# EAGLE design power (EAGLE 9.6.2)

## Sheet 1 of 4: main rov power

## Sheet 2 of 4: thrusters power
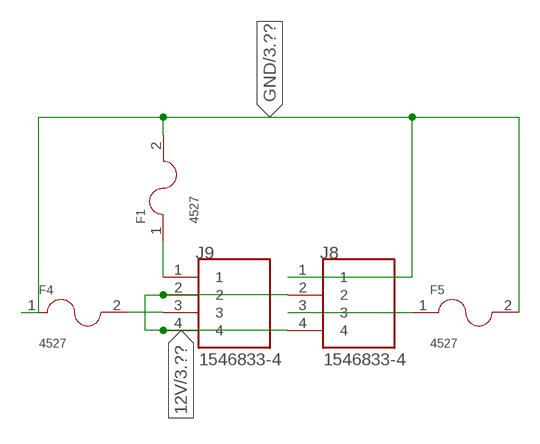
[diagram p0: schematic, sheet 2]

### Parts
F1  4527  [FUSE_4527]
F4  4527  [FUSE_4527]
F5  4527  [FUSE_4527]
J8  1546833-4  [TE_1546833-4]
J9  1546833-4  [TE_1546833-4]

### Nets
12V: J8.2 J8.4 J9.2 J9.4 ; also sheet 3,4
GND: F1.2 F4.1 F5.2 J8.1 ; also sheet 3,4
N$5: F4.2 J9.3
N$6: F5.1 J8.3
N$8: F1.1 J9.1

## Sheet 3 of 4: arm power + cameras power
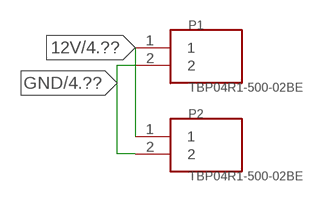
[diagram p1: schematic, sheet 3]

### Parts
P1  TBP04R1-500-02BE  [CUI_TBP04R1-500-02BE]
P2  TBP04R1-500-02BE  [CUI_TBP04R1-500-02BE]

### Nets
12V: P1.1 P2.1 ; also sheet 2,4
GND: P1.2 P2.2 ; also sheet 2,4

## Sheet 4 of 4: control power
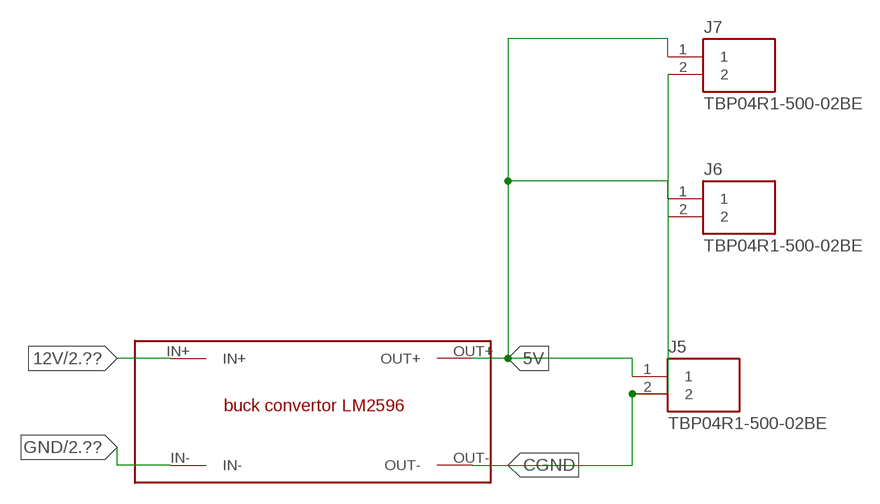
[diagram p2: schematic, sheet 4]

### Parts
J5  TBP04R1-500-02BE  [CUI_TBP04R1-500-02BE]
J6  TBP04R1-500-02BE  [CUI_TBP04R1-500-02BE]
J7  TBP04R1-500-02BE  [CUI_TBP04R1-500-02BE]
U$1  LM2596  [LM2596]

### Nets
5V: J5.1 J6.1 J7.1 U$1.OUT+
12V: U$1.IN+ ; also sheet 2,3
CGND: J5.2 J6.2 J7.2 U$1.OUT-
GND: U$1.IN- ; also sheet 2,3

## Library data of the parts
F1 F4 F5 = fuse holder:4527: Check availability <https://pricing.snapeda.com/parts/4527/Keystone/view-part?ref=eda>; AVAILABILITY: In Stock; CHECK_PRICES: https://www.snapeda.com/parts/4527/Keystone/view-part/?ref=eda; DESCRIPTION: 5mm Low Profile Holder; MF: Keystone; MP: 4527; PACKAGE: None; PRICE: None; SNAPEDA_LINK: https://www.snapeda.com/parts/4527/Keystone/view-part/?ref=snap
J5-J7 P1 P2 = pluggable terminal block:TBP04R1-500-02BE: Terminal Block Check availability <https://pricing.snapeda.com/parts/TBP04R1-500-02BE/Same%20Sky/view-part?ref=eda>; AVAILABILITY: In Stock; CHECK_PRICES: https://www.snapeda.com/parts/TBP04R1-500-02BE/Same+Sky/view-part/?ref=eda; DESCRIPTION: 2~24 Poles, Pluggable, Receptacle, Horizontal, 5.0 Pitch, Terminal Block Connector; MF: Same Sky; MP: TBP04R1-500-02BE; PACKAGE: None; PRICE: None; SNAPEDA_LINK: https://www.snapeda.com/parts/TBP04R1-500-02BE/Same+Sky/view-part/?ref=snap
J8 J9 = 1546833-4:1546833-4: Check availability <https://pricing.snapeda.com/parts/1546833-4/TE%20Connectivity/view-part?ref=eda>; AVAILABILITY: In Stock; CHECK_PRICES: https://www.snapeda.com/parts/1546833-4/TE+Connectivity+AMP+Connectors/view-part/?ref=eda; COMMENT: 1546833-4; DESCRIPTION: Conn Barrier Strip 4 POS 9.52mm Solder ST Thru-Hole 15A/Contact Package; EU_ROHS_COMPLIANCE: Compliant; MF: TE Connectivity; MP: 1546833-4; PACKAGE: None; PRICE: None; SNAPEDA_LINK: https://www.snapeda.com/parts/1546833-4/TE+Connectivity+AMP+Connectors/view-part/?ref=snap
U$1 = buck:LM2596

## Board
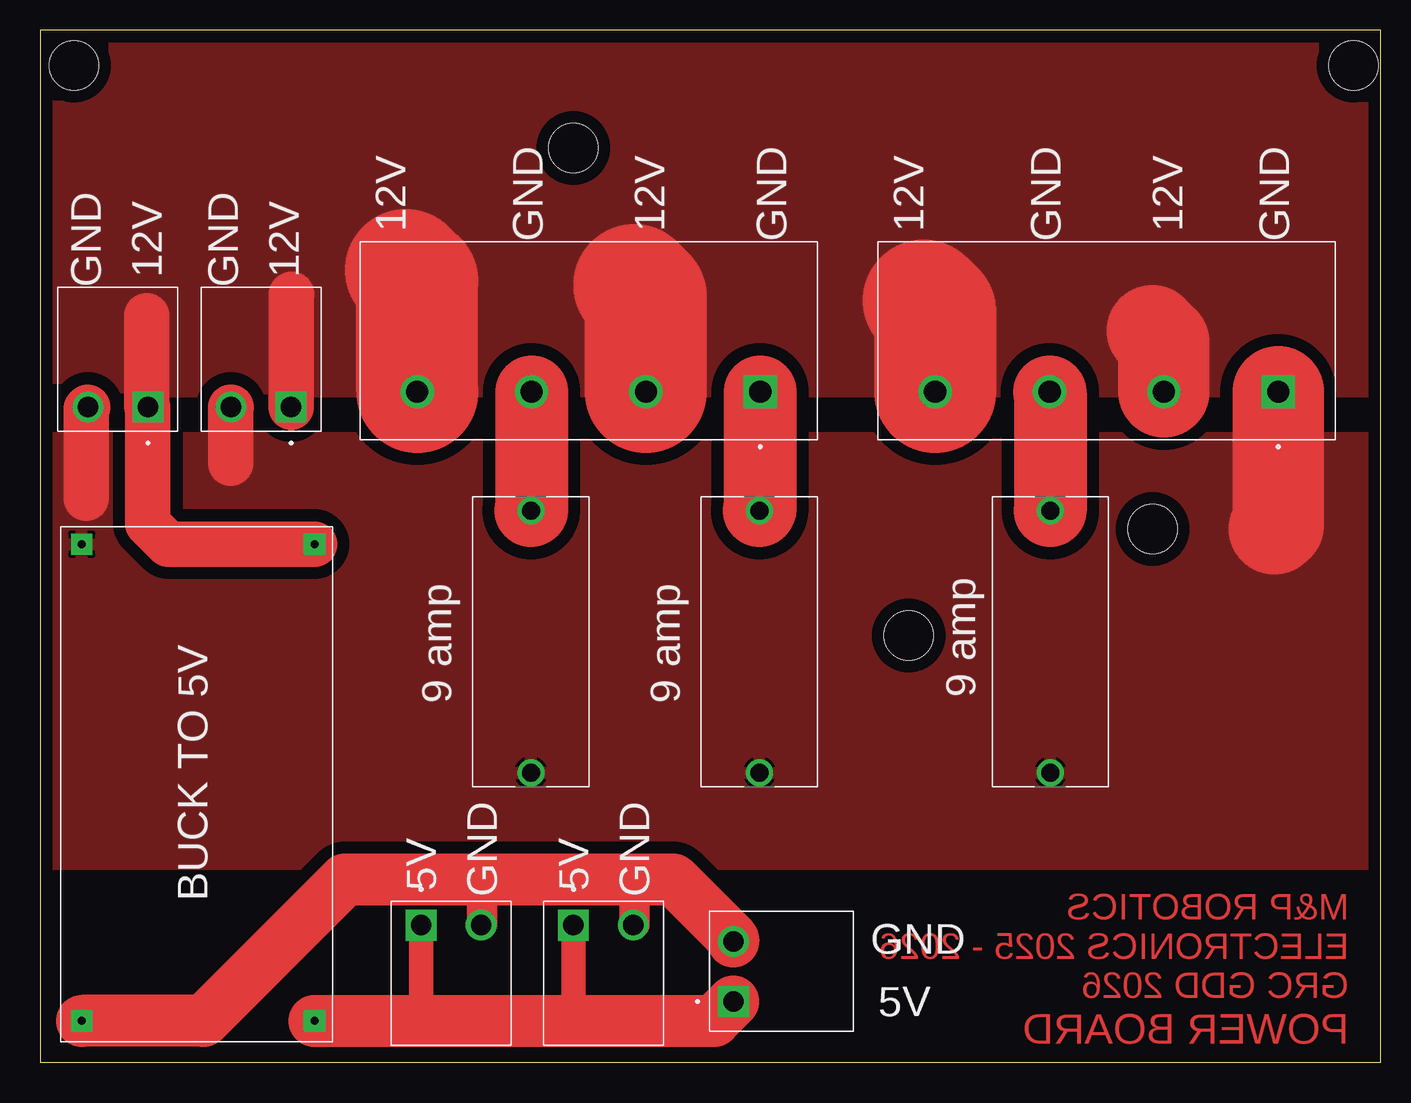
[diagram p3: board, top side]

Size 111.74 x 86.03 mm. Coordinates in mm from the lower left corner, seen from the top.
Outline: 0,0 111.74,0 111.74,86.03 0,86.03 0,0
Copper layers (1*16): Top 0.035mm / dielectric 1.5mm / Bottom 0.035mm
Design rules "default": minimum track width 6mil, minimum drill 0.35mm, track to track 6mil, track to pad 6mil, pad to pad 6mil, via to via 6mil, smd to smd 6mil, copper to edge 40mil, drill to drill 6mil, minimum pad ring 10mil, minimum via ring 8mil, stop-mask expansion 4mil, vias tented up to drill 0mil, thermal gap 10mil
Holes 4.1 mm at 2.79,83.06 109.47,83.06 72.39,35.56 44.45,76.2 92.71,44.45

### Footprints (pad centres in the part's own frame; a part is rotated, then mirrored left to right if it is on the bottom)
FUSE_4527 = drill 1.5: 1 -10.92,0; 2 10.92,0
CUI_TBP04R1-500-02BE = drill 1.7 square: 1 0,0 | drill 1.7: 2 5,0
TE_1546833-4 = drill 1.85 square: 1 -14.295,0 | drill 1.85: 2 -4.765,0; 3 4.765,0; 4 14.295,0
LM2596 = drill 0.65 pad 1.778 square: IN+ 0,0; IN- 0,-19.4; OUT+ 39.72,0; OUT- 39.72,-19.4

### Placement (x,y rotation side)
F1  59.94,35.05 270 top
F4  40.89,35.05 90 top
F5  84.2,35.05 270 top
J5  31.75,11.43 0 top
J6  57.78,5.08 90 top
J7  44.45,11.43 0 top
J8  88.9,55.88 180 top
J9  45.72,55.88 180 top
P1  8.97,54.61 180 top
P2  20.91,54.61 180 top
U$1  22.86,43.18 270 top

### Tracks (layer width: path | path; a pad name or v marks a point on that pad's centre or on a via)
5V
  Top 2.032: 31.75,3.46 J5.1 | 44.45,4.73 J7.1
  Top 2.54: 45.72,3.46 44.45,4.73
  Top 4.318: U$1.OUT+ 31.75,3.46 45.72,3.46 56.16,3.46 J6.1
12V
  Top 10.16: J9.4 31.43,65.09 30.48,66.04 | J9.2 50.48,63.81 49.53,64.77 | J8.4 74.61,62.55 73.66,63.5
  Top 3.81: P2.1 20.91,63.96 20.95,64.01 | 8.89,62.23 8.89,54.69 P1.1 8.97,44.88 10.67,43.18 U$1.IN+
  Top 7.62: J8.2 93.67,60.01 92.71,60.96
  pour Top (isolate 1.016): 111.76,55.88 0,55.88 0,86.36 111.76,86.36
CGND
  Top 2.54: J5.2 36.83,11.51 36.83,15.24 | J7.2 49.53,11.51 49.53,15.24
  Top 4.318: U$1.OUT- 13.62,3.46 25.4,15.24 36.83,15.24 49.53,15.24 52.78,15.24 57.78,10.24 J6.2
GND
  Top 3.81: P1.2 3.81,54.45 3.81,46.99 | P2.2 15.88,54.58 15.88,49.91
  Top 7.62: J8.1 103.19,44.77 102.87,44.45
  pour Top (isolate 1.016): 111.76,16.51 0,16.51 0,52.07 111.76,52.07
N$5
  Top 6.096: J9.3 40.95,46.03 F4.2
N$6
  Top 6.096: J8.3 84.2,55.81 F5.1
N$8
  Top 6.096: J9.1 60.02,46.17 F1.1

### Text on the board
Top: M&P ROBOTICS / ELECTRONICS 2025 - 2026 / GRC GDD 2026 | POWER BOARD
tPlace: 12V | GND | 12V | GND | 12V | GND | 12V | GND | GND | 12V | GND | 12V | 9 amp | 9 amp | 9 amp | BUCK TO 5V | GND | GND | 5V | 5V | GND | 5V